# Altium schematic sheet PowerSupply.SchDoc
size A3; SheetNumber: 3; SheetTotal: 3; SPICEModelCacheKPFIFKGG: <root> / <DocumentId>KPFIFKGG</DocumentId> / </root>
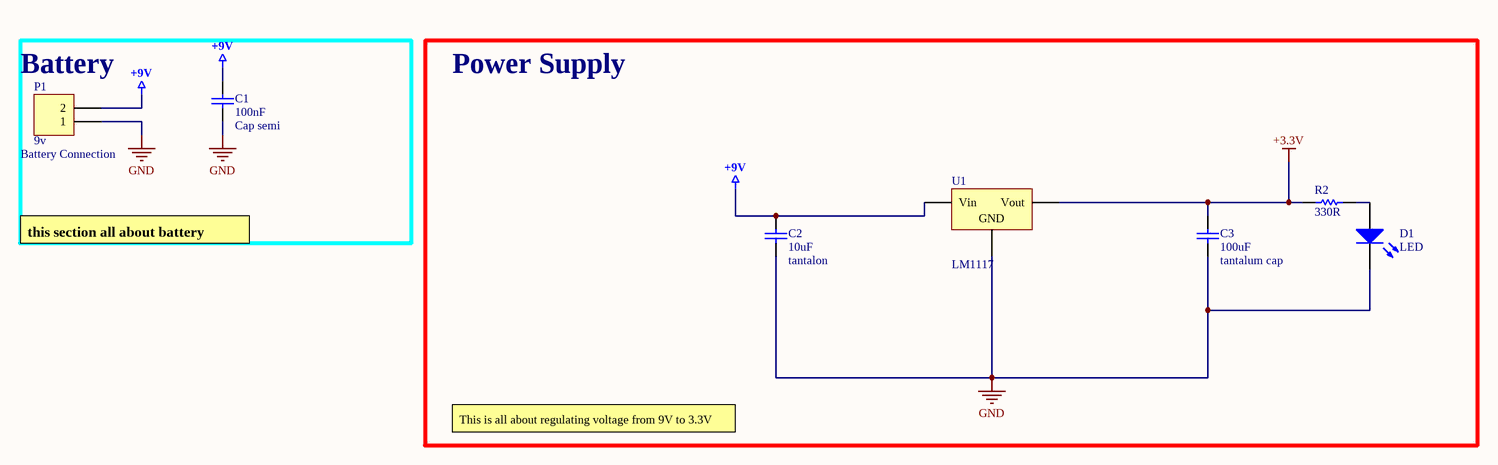
[diagram p0: PowerSupply.SchDoc]

## Parts
C1  100nF  [MY_0603]
C2  10uF  [MY_0603]
C3  100uF  [MY_0603]
D1  LED  [MY_LED_0805]
P1  Header 2  [My_ Power_Connector]  (value not drawn)
R2  330R  [MY_0805]
U1  LM1117  [MY_SOT223]

## Blocks framed on the sheet
Battery: C1 P1
Power Supply: C2 C3 D1 R2 U1

## Nets
+3.3V: C3.2 R2.1 U1.2(Vout)
+9V: C1.2 C2.2 P1.2 U1.3(Vin)
GND: C1.1 C2.1 C3.1 D1.K P1.1 U1.1(GND)
NetD1_A: D1.A R2.2

## Notes on the sheet
- (near P1) Battery Connection
- (near P1) 9v
- this section all about battery
- This is all about regulating voltage from 9V to 3.3V
- (in symbol Cap ceramic) Cap semi; tantalon; tantalum cap

## Library data of the parts
C1-C3 = Cap ceramic: None polar capacitor; ASiD Part Number: C-AS
  C1: Value: 100nF
  C2: Value: 10uF
  C3: Value: 100uF
D1 = LED: Typical INFRARED GaAs LED; ASiD Part Number: LED-AS
P1 = Header 2: Header, 2-Pin; ASiD Part Number: Header 2-AS
R2 = Res: Standard resistor; ASiD Part Number: Res-AS; Value: 330R
U1 = LM1117: Low Drop Voltage Reg; ASiD Part Number: LM1117-AS